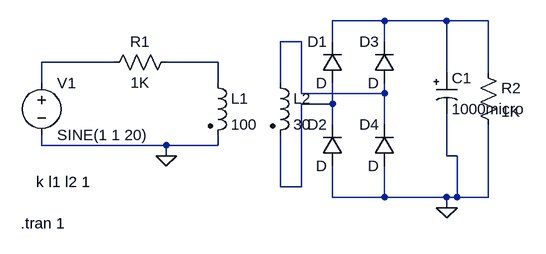
[diagram p0: schematic Full-wave Bridge Rectifier.asc]
Full-wave Bridge Rectifier.asc, the LTspice schematic file:
Version 4
SHEET 1 880 680
WIRE 288 -16 208 -16
WIRE 384 -16 288 -16
WIRE 448 -16 384 -16
WIRE 160 16 128 16
WIRE 208 16 208 -16
WIRE 288 16 288 -16
WIRE -128 48 -240 48
WIRE 32 48 -48 48
WIRE 384 64 384 -16
WIRE 448 64 448 -16
WIRE -240 80 -240 48
WIRE 32 80 32 48
WIRE 128 80 128 16
WIRE 160 96 160 16
WIRE 288 96 288 80
WIRE 288 96 160 96
WIRE 208 112 208 80
WIRE 208 112 160 112
WIRE 208 144 208 112
WIRE 288 144 288 96
WIRE -240 176 -240 160
WIRE -48 176 -240 176
WIRE 32 176 32 160
WIRE 32 176 -48 176
WIRE -48 192 -48 176
WIRE 384 192 384 128
WIRE 400 192 384 192
WIRE 128 240 128 160
WIRE 160 240 160 112
WIRE 160 240 128 240
WIRE 208 256 208 208
WIRE 288 256 288 208
WIRE 288 256 208 256
WIRE 384 256 288 256
WIRE 400 256 400 192
WIRE 400 256 384 256
WIRE 448 256 448 144
WIRE 448 256 400 256
WIRE 384 272 384 256
FLAG -48 192 0
FLAG 384 272 0
SYMBOL voltage -240 64 R0
WINDOW 123 0 0 Left 0
WINDOW 39 0 0 Left 0
SYMATTR InstName V1
SYMATTR Value SINE(1 1 20)
SYMBOL res -32 32 R90
WINDOW 0 0 56 VBottom 2
WINDOW 3 32 56 VTop 2
SYMATTR InstName R1
SYMATTR Value 1K
SYMBOL ind2 16 64 R0
SYMATTR InstName L1
SYMATTR Value 100
SYMATTR Type ind
SYMBOL diode 224 80 R180
WINDOW 0 24 64 Left 2
WINDOW 3 24 0 Left 2
SYMATTR InstName D1
SYMBOL diode 224 208 R180
WINDOW 0 24 64 Left 2
WINDOW 3 24 0 Left 2
SYMATTR InstName D2
SYMBOL diode 304 80 R180
WINDOW 0 24 64 Left 2
WINDOW 3 24 0 Left 2
SYMATTR InstName D3
SYMBOL diode 304 208 R180
WINDOW 0 24 64 Left 2
WINDOW 3 24 0 Left 2
SYMATTR InstName D4
SYMBOL res 432 48 R0
SYMATTR InstName R2
SYMATTR Value 1K
SYMBOL ind2 112 64 R0
SYMATTR InstName L2
SYMATTR Value 30
SYMATTR Type ind
SYMBOL polcap 368 64 R0
WINDOW 3 24 56 Left 2
SYMATTR Value 1000micro
SYMATTR InstName C1
SYMATTR Description Capacitor
SYMATTR Type cap
SYMATTR SpiceLine V=2 Irms=4.74342 Rser=0.01 Lser=0
TEXT -248 232 Left 2 !k l1 l2 1
TEXT -272 296 Left 2 !.tran 1

The netlist it stands for:
* Full-wave Bridge Rectifier.asc
V1 N003 0 SINE(1 1 20)
R1 N004 N003 1K
L1 N004 0 100
D1 N005 N001 D
D2 0 N005 D
D3 N002 N001 D
D4 0 N002 D
R2 N001 0 1K
L2 N002 N005 30
C1 N001 0 1000micro V=2 Irms=4.74342 Rser=0.01 Lser=0
.model D D
.lib standard.dio
k l1 l2 1
.tran 1
.backanno
.end